# Altium project 新控制图.PrjPcb
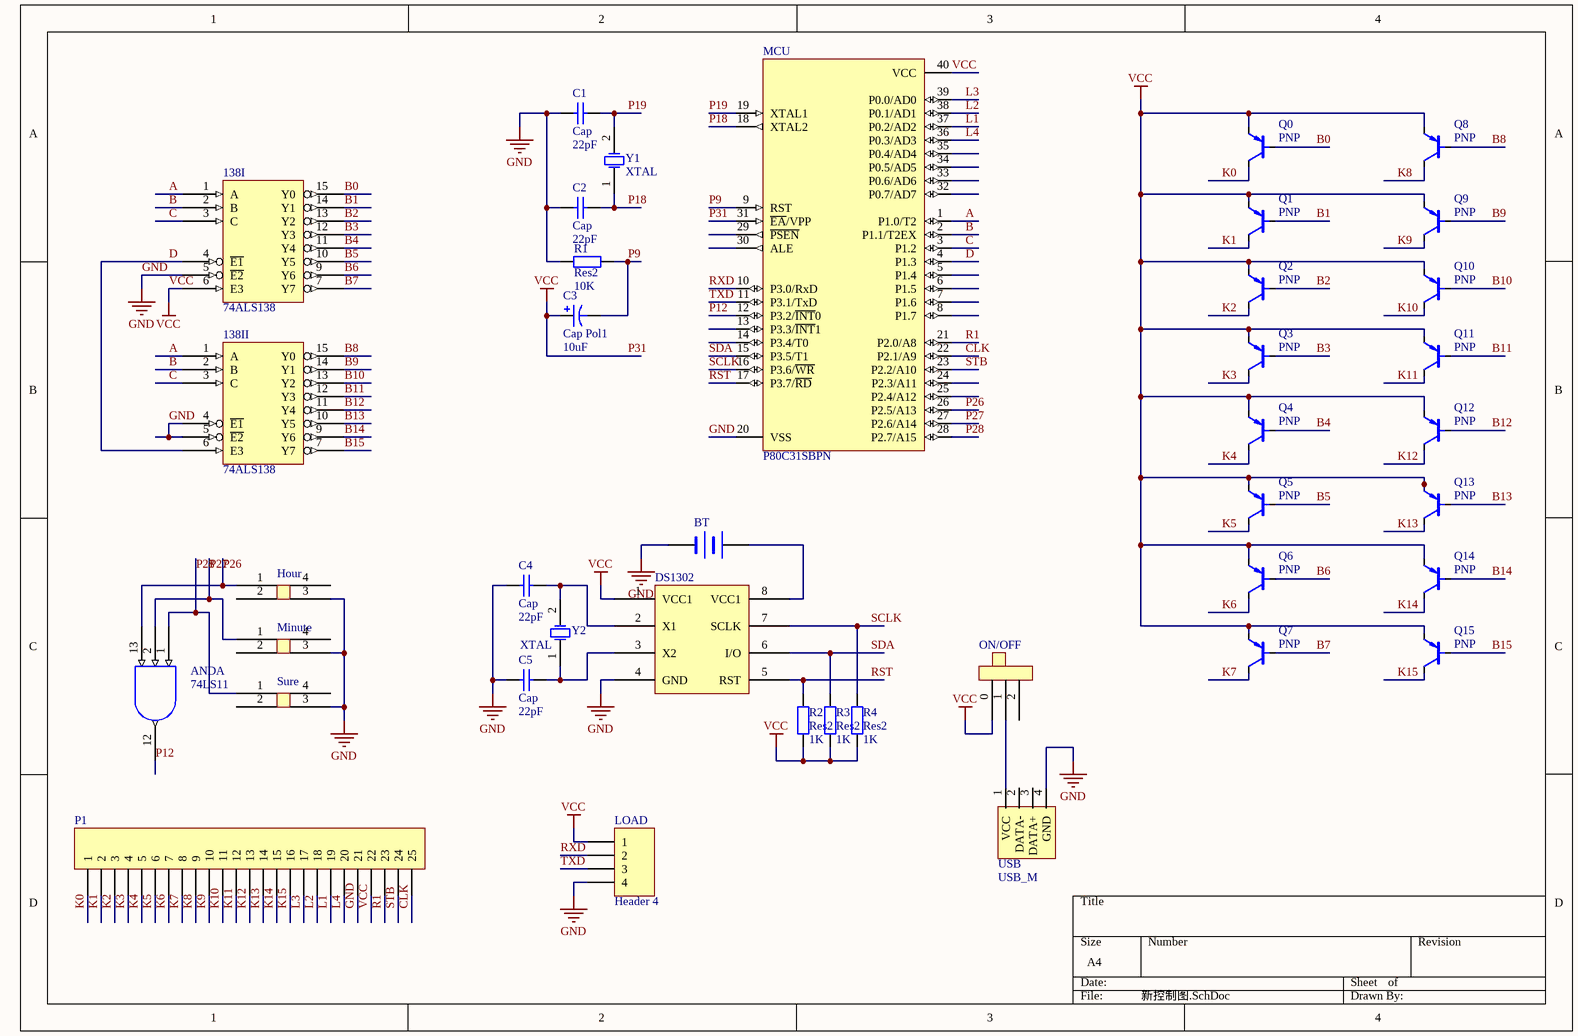
[diagram p0: 新控制图.SchDoc]
1 sheet, 40 parts. Net scope: global (net labels, ports and power ports of the same name join across sheets).
Board file: 新控制图.PcbDoc

## Sheet 新控制图.SchDoc
size A4

### Parts
138I  74ALS138  [DIP-16]
138II  74ALS138  [DIP-16]
AND  74LS11  [DIP-14]  (part A of 3)
BT  (no value)  [PCBComponent_1]
C1  Cap  value 22pF  [HDR1X2]
C2  Cap  value 22pF  [HDR1X2]
C3  Cap Pol1  value 10uF  [LED]
C4  Cap  value 22pF  [PIN2]
C5  Cap  value 22pF  [PIN2]
DS1302  (no value)  [DIP8]
Hour  (no value)  [PCBComponent_1]
LOAD  Header 4  [HDR1X4]
MCU  P80C31SBPN  [SOT129-1]
Minute  (no value)  [PCBComponent_1]
ON/OFF  (no value)  [PCBComponent_1]
P1  (no value)  [HDR1X25]
Q0  PNP  [TO-92]
Q1  PNP  [TO-92]
Q2  PNP  [TO-92]
Q3  PNP  [TO-92]
Q4  PNP  [TO-92]
Q5  PNP  [TO-92]
Q6  PNP  [TO-92]
Q7  PNP  [TO-92]
Q8  PNP  [TO-92]
Q9  PNP  [TO-92]
Q10  PNP  [TO-92]
Q11  PNP  [TO-92]
Q12  PNP  [TO-92]
Q13  PNP  [TO-92]
Q14  PNP  [TO-92]
Q15  PNP  [TO-92]
R1  Res2  value 10K  [AXIAL-0.4]
R2  Res2  value 1K  [AXIAL-0.4]
R3  Res2  value 1K  [AXIAL-0.4]
R4  Res2  value 1K  [AXIAL-0.4]
Sure  (no value)  [PCBComponent_1]
USB  USB_M  [USB]
Y1  XTAL  [PCBComponent_1]
Y2  XTAL  [HDR1X2]

### Nets
GND: 138I.5(~{E2}) 138I.8(GND) 138II.4(~{E1}) 138II.5(~{E2}) 138II.8(GND) AND.7(GND) BT.2(-) C1.1 C2.1 C4.1 C5.1 DS1302.4(GND) Hour.3 LOAD.4 MCU.20(VSS) Minute.3 P1.21 R1.1 Sure.3 USB.4(GND)
P31: 138I.6(E3) 138I.16(VCC) 138II.16(VCC) AND.14(VCC) C3.1 DS1302.1(VCC1) LOAD.1 MCU.31(~{EA}/VPP) MCU.40(VCC) ON/OFF.0 P1.22 Q0.E(e) Q1.E(e) Q2.E(e) Q3.E(e) Q4.E(e) Q5.E(e) Q6.E(e) Q7.E(e) Q8.E(e) Q9.E(e) Q10.E(e) Q11.E(e) Q12.E(e) Q13.E(e) Q14.E(e) Q15.E(e) R2.1 R3.1 R4.1  [also labelled VCC]
A: 138I.1(A) 138II.1(A) MCU.1(P1.0/T2)
B: 138I.2(B) 138II.2(B) MCU.2(P1.1/T2EX)
B0: 138I.15(Y0) Q0.B(b)
B1: 138I.14(Y1) Q1.B(b)
B2: 138I.13(Y2) Q2.B(b)
B3: 138I.12(Y3) Q3.B(b)
B4: 138I.11(Y4) Q4.B(b)
B5: 138I.10(Y5) Q5.B(b)
B6: 138I.9(Y6) Q6.B(b)
B7: 138I.7(Y7) Q7.B(b)
B8: 138II.15(Y0) Q8.B(b)
B9: 138II.14(Y1) Q9.B(b)
B10: 138II.13(Y2) Q10.B(b)
B11: 138II.12(Y3) Q11.B(b)
B12: 138II.11(Y4) Q12.B(b)
B13: 138II.10(Y5) Q13.B(b)
B14: 138II.9(Y6) Q14.B(b)
B15: 138II.7(Y7) Q15.B(b)
C: 138I.3(C) 138II.3(C) MCU.3(P1.2)
CLK: MCU.22(P2.1/A9) P1.25
D: 138I.4(~{E1}) 138II.6(E3) MCU.4(P1.3)
K0: P1.1 Q0.C(c)
K1: P1.2 Q1.C(c)
K2: P1.3 Q2.C(c)
K3: P1.4 Q3.C(c)
K4: P1.5 Q4.C(c)
K5: P1.6 Q5.C(c)
K6: P1.7 Q6.C(c)
K7: P1.8 Q7.C(c)
K8: P1.9 Q8.C(c)
K9: P1.10 Q9.C(c)
K10: P1.11 Q10.C(c)
K11: P1.12 Q11.C(c)
K12: P1.13 Q12.C(c)
K13: P1.14 Q13.C(c)
K14: P1.15 Q14.C(c)
K15: P1.16 Q15.C(c)
L1: MCU.37(P0.2/AD2) P1.19
L2: MCU.38(P0.1/AD1) P1.18
L3: MCU.39(P0.0/AD0) P1.17
L4: MCU.36(P0.3/AD3) P1.20
P9: C3.2 MCU.9(RST) R1.2
P12: AND.12 MCU.12(P3.2/~{INT}0)
P18: C2.2 MCU.18(XTAL2) Y1.1(OSC1)
P19: C1.2 MCU.19(XTAL1) Y1.2(OSC2)
P26: AND.13 Hour.1 MCU.26(P2.5/A13)
P27: AND.2 MCU.27(P2.6/A14) Minute.1
P28: AND.1 MCU.28(P2.7/A15) Sure.1
R1: MCU.21(P2.0/A8) P1.23
RST: DS1302.5(RST) MCU.17(P3.7/~{RD}) R2.2
RXD: LOAD.2 MCU.10(P3.0/RxD)
SCLK: DS1302.7(SCLK) MCU.16(P3.6/~{WR}) R4.2
SDA: DS1302.6(I/O) MCU.15(P3.5/T1) R3.2
STB: MCU.23(P2.2/A10) P1.24
TXD: LOAD.3 MCU.11(P3.1/TxD)
NetBT_1: BT.1(+) DS1302.8(VCC1)
NetC4_2: C4.2 DS1302.2(X1) Y2.2(OSC2)
NetC5_2: C5.2 DS1302.3(X2) Y2.1(OSC1)
NetON/OFF_1: ON/OFF.1 USB.1(VCC)

Not connected (* = marked no-connect by the designer): Hour 2 4; MCU 5(P1.4) 6(P1.5) 7(P1.6) 8(P1.7) 13(P3.3/~{INT}1) 14(P3.4/T0) 24(P2.3/A11) 25(P2.4/A12) 29(~{PSEN}) 30(ALE) 32(P0.7/AD7) 33(P0.6/AD6) 34(P0.5/AD5) 35(P0.4/AD4); Minute 2 4; ON/OFF 2; Sure 2 4; USB 2(DATA-) 3(DATA+)

### Library data of the parts
BT = 干电池: Battery
C1 C2 C4 C5 = Cap: Capacitor; Published: 8-Jun-2000; LatestRevisionDate: 17-Jul-2002; LatestRevisionNote: Re-released for DXP Platform.; PackageReference: RAD-0.3; Publisher: Altium Limited
C3 = Cap Pol1: Polarized Capacitor (Radial); Published: 8-Jun-2000; LatestRevisionDate: 17-Jul-2002; LatestRevisionNote: Re-released for DXP Platform.; PackageReference: RB7.6-15; Publisher: Altium Limited
DS1302 Hour Minute ON/OFF Sure = Component_1
LOAD = Header 4: Header, 4-Pin; LatestRevisionDate: 17-Jul-2002; LatestRevisionNote: Re-released for DXP Platform.; Publisher: Altium Limited
MCU = P80C31SBPN: 80C51 8-Bit Microcontroller Family: 128 B RAM, ROMless, 2.7 V-5.5 V, Low Power, High Speed; Published: 21-May-2003; DatasheetVersion: 7-Aug-2000; PackageVersion: Aug-2000; PackageReference: SOT129-1; Publisher: Altium Limited; PackageDescription: DIP, Plastic; 40 Leads; Row Spacing 15.24 mm; Pitch 2.54 mm; Code_JEDEC: MO-015; ComponentLink1Description: Manufacturer Link; ComponentLink1URL: http://www-us2.semiconductors.philips.com/; ComponentLink2Description: Datasheet; ComponentLink2URL: http://www.semiconductors.philips.com/acrobat/datasheets/80C31_80C32_1.pdf; ComponentLink3Description: Discontinuation Notice; ComponentLink3URL: http://www.semiconductors.philips.com/acrobat_download/other/eol/dn43exha.pdf
P1 = Header 25: Header, 25-Pin; LatestRevisionDate: 17-Jul-2002; LatestRevisionNote: Re-released for DXP Platform.; Publisher: Altium Limited
R1-R4 = Res2: Resistor; Published: 8-Jun-2000; LatestRevisionDate: 17-Jul-2002; LatestRevisionNote: Re-released for DXP Platform.; PackageReference: AXIAL-0.4; Publisher: Altium Limited
Y1 Y2 = XTAL: Crystal Oscillator; Published: 8-Jun-2000; LatestRevisionDate: 17-Jul-2002; LatestRevisionNote: Re-released for DXP Platform.; PackageReference: R38; Publisher: Altium Limited